# Altium project bch-node_v0.2.PrjPcb (part 2 of 2)
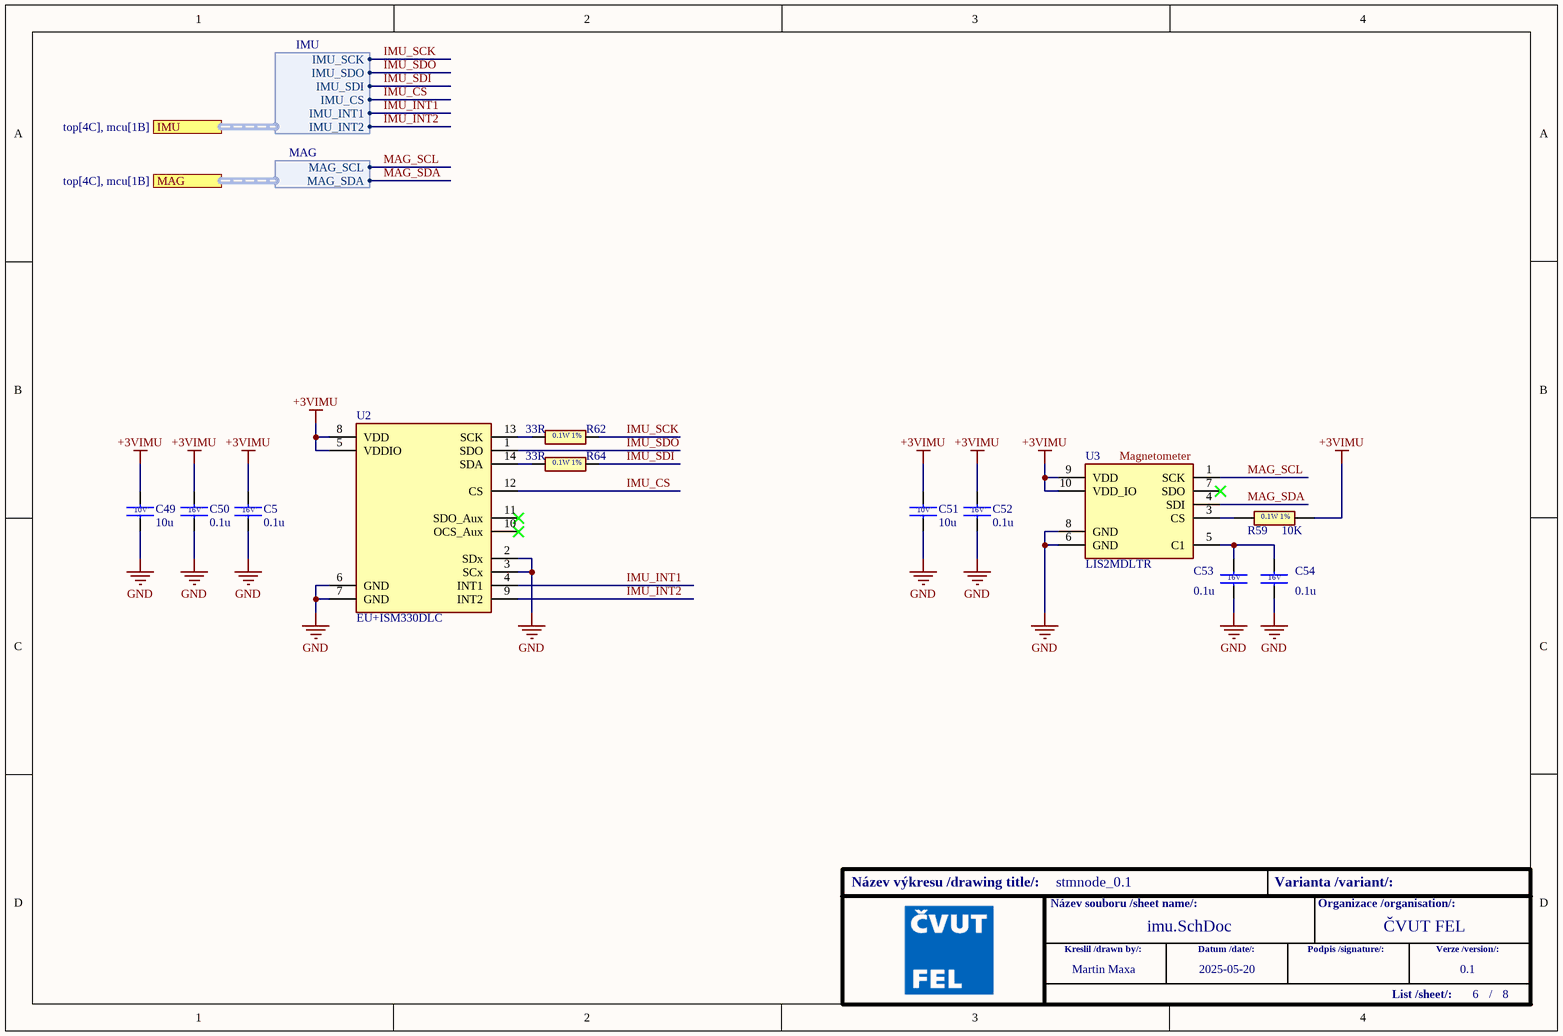
[diagram p6: imu.SchDoc]

## Nets that join several sheets
+3V: top (J6.4 J10.1 J11.1), power (9 pins), mcu (32 pins)
+3VIMU: power (R58.2 U13.6), imu (10 pins)
+3VLORA: lora (C9.1 C29.1 R12.2 U6.9), power (R57.2 U12.6)
+V_USB: top (J5.A4 J5.A9 U7.5), power (C31.1 C32.1 U8.6)
GND: top (22 pins), gps (18 pins), lora (C9.2 C29.2 U6.1), power (22 pins), mcu (41 pins), imu (13 pins)
1PPS: gps (U1.4), mcu (U4.132)
BAT+: top (F1.2), power (8 pins)
BUSY: lora (U6.14), mcu (U4.47)
CLK: lora (R3.1), mcu (U4.41)
DIO1: lora (U6.13), mcu (U4.48)
DIO2: lora (U6.8), mcu (U4.49)
~{GPS_RESET}: gps (R30.1 U1.9), mcu (U4.135)
GPS_RX: gps (R37.1), mcu (U4.140)
GPS_SCL: gps (R36.1), mcu (U4.136)
GPS_SDA: gps (R35.1), mcu (U4.137)
GPS_TX: gps (R38.1), mcu (U4.139)
GPS_WAKE-UP: gps (U1.5), mcu (U4.134)
IMU_CS: mcu (U4.114), imu (U2.12)
IMU_INT1: mcu (U4.110), imu (U2.4)
IMU_INT2: mcu (U4.117), imu (U2.9)
IMU_SCK: mcu (U4.111), imu (R62.2)
IMU_SDI: mcu (U4.113), imu (R64.2)
IMU_SDO: mcu (U4.112), imu (U2.1)
LORA_MISO: lora (U6.16), mcu (U4.42)
LORA_MOSI: lora (R4.1), mcu (U4.43)
LORA_NRST: lora (U6.15), mcu (U4.44)
LORA_NSS: lora (R12.1 U6.19), mcu (U4.40)
LORA_RXEN: lora (U6.6), mcu (U4.45)
LORA_TXEN: lora (U6.7), mcu (U4.46)
MAG_SCL: mcu (U4.11), imu (U3.1)
MAG_SDA: mcu (U4.10), imu (U3.4)
NetU4_58: power (U12.3), mcu (U4.58)
NetU4_128: power (U13.3), mcu (U4.128)
PDM_CLK: top (R56.2), mcu (U4.1)
PDM_D1: top (R52.2), mcu (U4.5)
PDM_D2: top (R53.2), mcu (U4.3)
PDM_D3: top (R54.2), mcu (U4.22)
SD_CS: top (R39.2), mcu (U4.13)
SD_DET: top (R43.2), mcu (U4.12)
SD_MISO: top (R42.2), mcu (U4.20)
SD_MOSI: top (R40.2), mcu (U4.21)
SD_SCK: top (R41.2), mcu (U4.19)
USB_D_N: top (U7.4), mcu (U4.103)
USB_D_P: top (U7.6), mcu (U4.104)

## Assembly variants
node: not fitted C8 C35 C36 J2 R1 R20 R33 R?